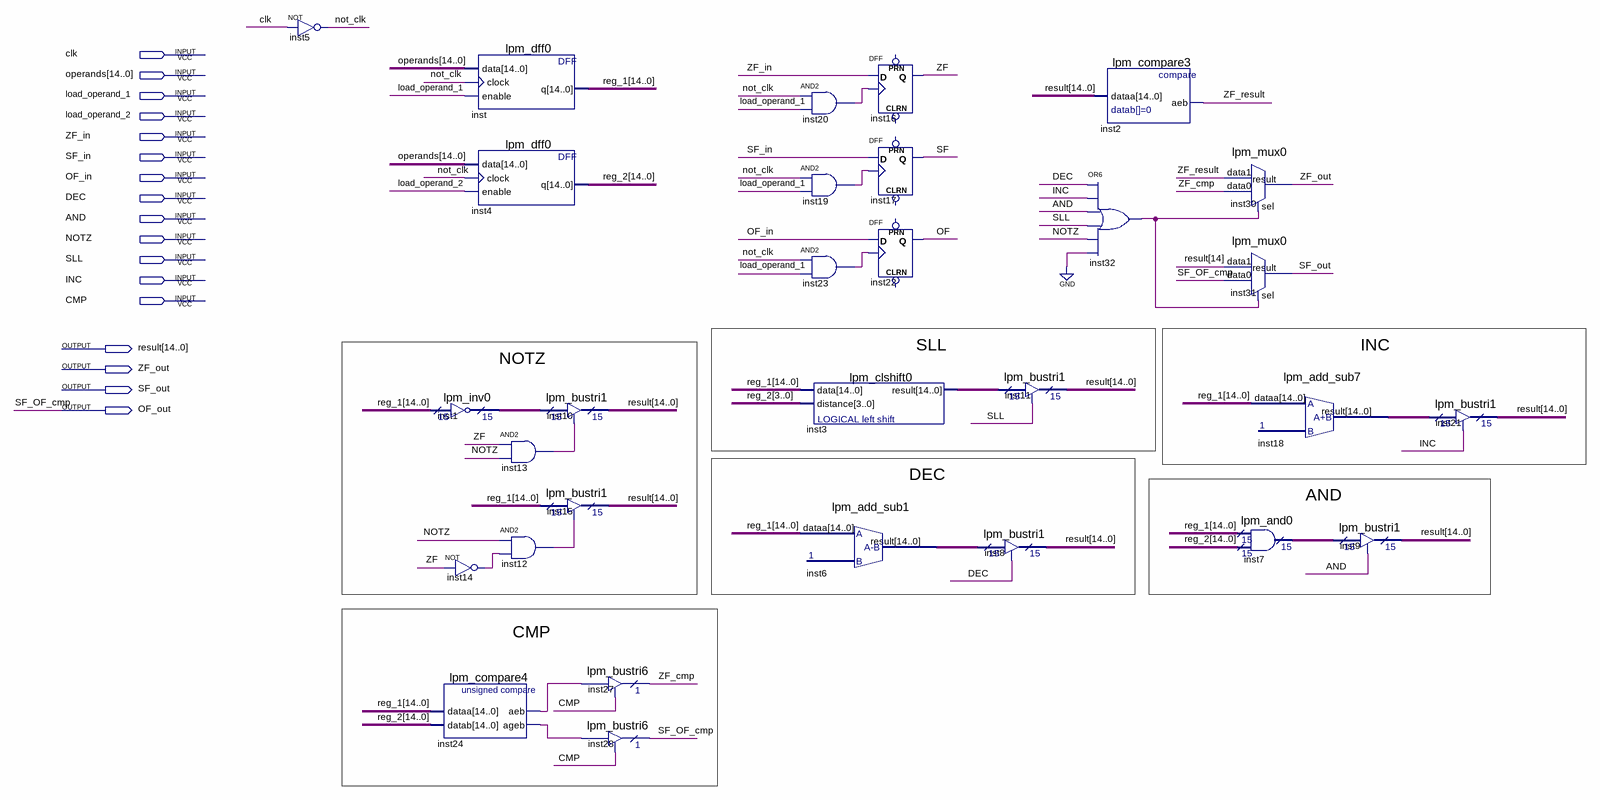
[diagram p0: schematic sheet]
// Quartus schematic arithmetic_logic_unit.bdf as structural Verilog: 30 symbols, 17 pins
module arithmetic_logic_unit (
  input  clk,
  input  [14:0] operands,
  input  load_operand_1,
  input  load_operand_2,
  input  ZF_in,
  input  SF_in,
  input  OF_in,
  input  DEC,
  input  AND,
  input  NOTZ,
  input  SLL,
  input  INC,
  input  CMP,
  output [14:0] result,
  output ZF_out,
  output SF_out,
  output OF_out
);

  wire inst12_out, inst13_out, inst14_out, inst19_out, inst20_out, inst23_out, inst24_aeb, inst24_ageb,
       inst32_out, not_clk, OF, SF, ZF, ZF_cmp, ZF_result;
  wire [14:0] inst1_result, inst3_result, inst6_result, inst7_result, inst18_result, reg_1, reg_2;

  not inst5 (not_clk, clk);
  lpm_inv0 inst1 (.data(reg_1), .result(inst1_result));
  lpm_compare4 inst24 (.dataa(reg_1), .datab(reg_2), .aeb(inst24_aeb), .ageb(inst24_ageb));
  lpm_dff0 inst (.data(operands), .clock(not_clk), .enable(load_operand_1), .q(reg_1));
  lpm_dff0 inst4 (.data(operands), .clock(not_clk), .enable(load_operand_2), .q(reg_2));
  not inst14 (inst14_out, ZF);
  lpm_bustri1 inst10 (.enabledt(inst13_out), .data(inst1_result), .tridata(result));
  and inst13 (inst13_out, ZF, NOTZ);
  lpm_bustri1 inst15 (.enabledt(inst12_out), .data(reg_1), .tridata(result));
  and inst12 (inst12_out, NOTZ, inst14_out);
  lpm_bustri6 inst27 (.enabledt(CMP), .data(inst24_aeb), .tridata(ZF_cmp));
  lpm_bustri6 inst28 (.enabledt(CMP), .data(inst24_ageb), .tridata(OF_out));
  and inst20 (inst20_out, not_clk, load_operand_1);
  and inst19 (inst19_out, not_clk, load_operand_1);
  and inst23 (inst23_out, not_clk, load_operand_1);
  lpm_clshift0 inst3 (.data(reg_1), .distance(reg_2[3:0]), .result(inst3_result));
  lpm_add_sub1 inst6 (.dataa(reg_1), .result(inst6_result));
  DFF inst16 (.CLK(inst20_out), .D(ZF_in), .Q(ZF));  // open: CLRN, PRN
  DFF inst17 (.CLK(inst19_out), .D(SF_in), .Q(SF));  // open: CLRN, PRN
  DFF inst22 (.CLK(inst23_out), .D(OF_in), .Q(OF));  // open: CLRN, PRN
  lpm_bustri1 inst8 (.enabledt(DEC), .data(inst6_result), .tridata(result));
  lpm_bustri1 inst11 (.enabledt(SLL), .data(inst3_result), .tridata(result));
  or inst32 (inst32_out, DEC, INC, AND, SLL, NOTZ, 1'b0);
  lpm_compare3 inst2 (.dataa(result), .aeb(ZF_result));
  lpm_mux0 inst30 (.data1(ZF_result), .data0(ZF_cmp), .sel(inst32_out), .result(ZF_out));
  lpm_mux0 inst31 (.data1(result[14]), .data0(OF_out), .sel(inst32_out), .result(SF_out));
  lpm_add_sub7 inst18 (.dataa(reg_1), .result(inst18_result));
  lpm_and0 inst7 (.data0x(reg_1), .data1x(reg_2), .result(inst7_result));
  lpm_bustri1 inst9 (.enabledt(AND), .data(inst7_result), .tridata(result));
  lpm_bustri1 inst21 (.enabledt(INC), .data(inst18_result), .tridata(result));

  // Other names for the same wires on the sheet: SF_OF_cmp = OF_out

  // Notes on the sheet:
  //   SLL
  //   INC
  //   NOTZ
  //   DEC
  //   AND
  //   CMP
endmodule
